# Altium schematic sheet ESP32-SCHEMATIC.SchDoc (part 3 of 3)
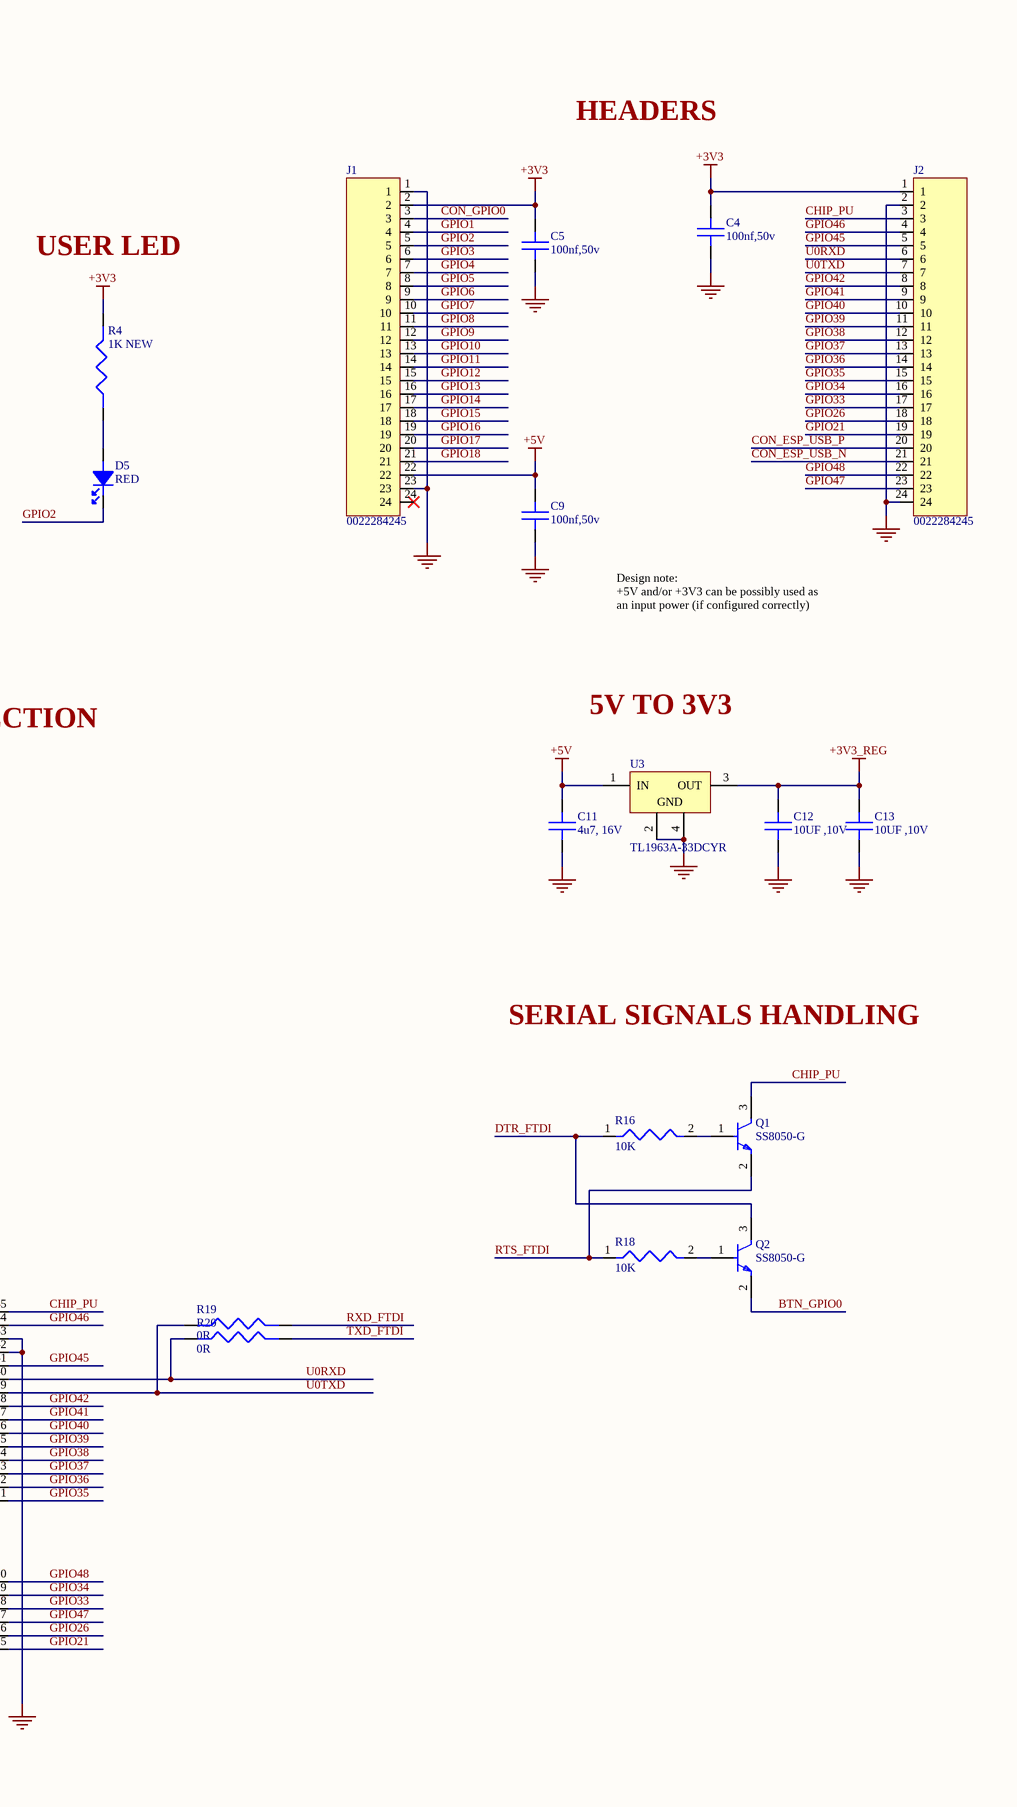
[diagram p3: ESP32-SCHEMATIC.SchDoc, right]

## Library data of the parts (continued)
R9 R13 R16-R18 = SR0402FR-0710KL: 62.5mW Thick Film Resistors 50V ±100ppm/℃ ±1% 10kΩ 0402 Chip Resistor - Surface Mount ROHS; Manufacturer: Yageo Group; Max Power Dissipation: 63mW; Temperature Coefficient: 100ppm/°C; Working Voltage: 75V; Supplier: DigiKey; Supplier Part Number: 13-SR0402FR-0710KLCT-ND; Manufacturer Part Number: SR0402FR-0710KL; RoHS: Compliant; Category: Chip SMD Resistors; Stock: 17860; Pricing: 1=0.24, 10=0.155, 25=0.1444, 50=0.1336, 100=0.101, 250=0.0918, 500=0.08262, 1000=0.07242, 5000=0.0612 (USD); Case/Package: 0402; China RoHS: Non-Compliant; Composition: Thick Film; Features: Automotive AEC-Q200; Height: 350µm; Length: 990.6µm; Lifecycle Status: Production; Max Operating Temperature: 155°C; Min Operating Temperature: -55°C; Mounting Technology: Surface Mount; Number of Terminals: 2; Number of Terminations: 2; Packaging: Tape & Reel; Power Dissipation: 62.5mW; Power Rating: 62.5mW; REACH SVHC: Yes; Value: 10kΩ; Tolerance: 1%; Voltage Rating: 50V; Width: 500µm; ComponentLink1URL: https://datasheet.octopart.com:443/SR0402FR-0710KL-Yageo-datasheet-176402240.pdf?src-supplier=IHS; ComponentLink1Description: https://datasheet.octopart.com:443/SR0402FR-0710KL-Yageo-datasheet-176402240.pdf?src-supplier=IHS; ComponentLink2URL: https://datasheet.octopart.com:443/SR0402FR-0710KL-Yageo-datasheet-119732217.pdf?src-supplier=Upverter; ComponentLink2Description: https://datasheet.octopart.com:443/SR0402FR-0710KL-Yageo-datasheet-119732217.pdf?src-supplier=Upverter; ComponentLink3URL: https://datasheet.octopart.com:443/SR0402FR-0710KL-Yageo-Group-datasheet-155675517.pdf?src-supplier=ODG+(Origin+Data+Global); ComponentLink3Description: https://datasheet.octopart.com:443/SR0402FR-0710KL-Yageo-Group-datasheet-155675517.pdf?src-supplier=ODG+(Origin+Data+Global); ComponentLink4URL: https://datasheet.octopart.com/SR0402FR-0710KL-Yageo-datasheet-11047080.pdf; ComponentLink4Description: https://datasheet.octopart.com/SR0402FR-0710KL-Yageo-datasheet-11047080.pdf; ComponentLink5URL: http://sigma.octopart.com:80/rohs_statement/Yageo-company-2.pdf?src-supplier=Compliance+Statements; ComponentLink5Description: http://sigma.octopart.com:80/rohs_statement/Yageo-company-2.pdf?src-supplier=Compliance+Statements; ComponentLink6URL: http://sigma.octopart.com:80/conflict_mineral_statement/Yageo-company-3.pdf?src-supplier=Compliance+Statements; ComponentLink6Description: http://sigma.octopart.com:80/conflict_mineral_statement/Yageo-company-3.pdf?src-supplier=Compliance+Statements
R10 = RC0402FR-074K7L: Res General Purpose Thick Film 0402 4.7K Ohm 1% 1/16W ±100ppm/°C Molded SMD Paper T/R; Manufacturer: Yageo Group; Power Dissipation: 62.5mW; Power Rating: 63mW; Value: 4.7kΩ; Voltage Rating: 50V; Supplier: DigiKey; Supplier Part Number: 311-4.7KLRDKR-ND; Manufacturer Part Number: RC0402FR-074K7L; RoHS: Compliant; Category: Chip SMD Resistors; Stock: 3604211; Pricing: 1=0.1, 10=0.010, 25=0.008, 50=0.0062, 100=0.0056, 250=0.00508, 500=0.00408 (USD); Case/Package: 0402; Case Code (Imperial): 0402; Case Code (Metric): 1005; China RoHS: Non-Compliant; Composition: Thick Film; Depth: 500µm; Height: 350µm; Lead Free: Lead Free; Length: 1mm; Lifecycle Status: Production; Max Operating Temperature: 155°C; Military Standard: Not; Min Operating Temperature: -55°C; Mounting Technology: Surface Mount; Pins: 2; Number of Terminals: 2; Packaging: Tape & Reel; REACH SVHC: Yes; Schedule B: 8533210045, 8533210045|8533210045, 8533210045|8533210045|8533210045, 8533210045|8533210045|8533210045|8533210045; Temperature Coefficient: 100ppm/°C; Termination: SMD/SMT; Tolerance: 1%; Voltage Rating (AC): 50V; Voltage Rating (DC): 50V; Width: 500µm; Working Voltage: 50V; ComponentLink1URL: https://datasheet.octopart.com:443/RC0402FR-074K7L-Yageo-datasheet-175887523.pdf?src-supplier=IHS; ComponentLink1Description: https://datasheet.octopart.com:443/RC0402FR-074K7L-Yageo-datasheet-175887523.pdf?src-supplier=IHS; ComponentLink2URL: https://datasheet.octopart.com:443/RC0402FR-074K7L-Yageo-datasheet-103092701.pdf?src-supplier=Upverter; ComponentLink2Description: https://datasheet.octopart.com:443/RC0402FR-074K7L-Yageo-datasheet-103092701.pdf?src-supplier=Upverter; ComponentLink3URL: https://datasheet.octopart.com:443/RC0402FR-074K7L-Yageo-datasheet-98239111.pdf?src-supplier=Upverter; ComponentLink3Description: https://datasheet.octopart.com:443/RC0402FR-074K7L-Yageo-datasheet-98239111.pdf?src-supplier=Upverter; ComponentLink4URL: https://datasheet.octopart.com:443/RC0402FR-074K7L-Yageo-datasheet-10408619.pdf?src-supplier=element14+APAC; ComponentLink4Description: https://datasheet.octopart.com:443/RC0402FR-074K7L-Yageo-datasheet-10408619.pdf?src-supplier=element14+APAC; ComponentLink5URL: https://datasheet.octopart.com:443/RC0402FR-074K7L-Yageo-datasheet-13691069.pdf?src-supplier=element14+APAC; ComponentLink5Description: https://datasheet.octopart.com:443/RC0402FR-074K7L-Yageo-datasheet-13691069.pdf?src-supplier=element14+APAC; ComponentLink6URL: https://datasheet.octopart.com:443/RC0402FR-074K7L-Yageo-datasheet-12531192.pdf?src-supplier=Newark; ComponentLink6Description: https://datasheet.octopart.com:443/RC0402FR-074K7L-Yageo-datasheet-12531192.pdf?src-supplier=Newark; ComponentLink7URL: https://datasheet.octopart.com:443/RC0402FR-074K7L-Yageo-datasheet-8324527.pdf?src-supplier=Newark; ComponentLink7Description: https://datasheet.octopart.com:443/RC0402FR-074K7L-Yageo-datasheet-8324527.pdf?src-supplier=Newark; ComponentLink8URL: https://datasheet.octopart.com:443/RC0402FR-074K7L-Yageo-datasheet-62067350.pdf?src-supplier=Farnell; ComponentLink8Description: https://datasheet.octopart.com:443/RC0402FR-074K7L-Yageo-datasheet-62067350.pdf?src-supplier=Farnell; ComponentLink9URL: https://datasheet.octopart.com:443/RC0402FR-074K7L-Yageo-datasheet-8329306.pdf?src-supplier=element14; ComponentLink9Description: https://datasheet.octopart.com:443/RC0402FR-074K7L-Yageo-datasheet-8329306.pdf?src-supplier=element14; ComponentLink10URL: https://datasheet.octopart.com:443/RC0402FR-074K7L-Yageo-datasheet-175423674.pdf?src-supplier=SOS+electronic; ComponentLink10Description: https://datasheet.octopart.com:443/RC0402FR-074K7L-Yageo-datasheet-175423674.pdf?src-supplier=SOS+electronic; ComponentLink11URL: https://datasheet.octopart.com:443/RC0402FR-074K7L-Yageo-datasheet-164759695.pdf?src-supplier=Future+Electronics; ComponentLink11Description: https://datasheet.octopart.com:443/RC0402FR-074K7L-Yageo-datasheet-164759695.pdf?src-supplier=Future+Electronics; ComponentLink12URL: https://datasheet.octopart.com:443/RC0402FR-074K7L-Yageo-datasheet-137700087.pdf?src-supplier=Future+Electronics; ComponentLink12Description: https://datasheet.octopart.com:443/RC0402FR-074K7L-Yageo-datasheet-137700087.pdf?src-supplier=Future+Electronics; ComponentLink13URL: https://datasheet.octopart.com:443/RC0402FR-074K7L-Yageo-datasheet-79472498.pdf?src-supplier=Megastar; ComponentLink13Description: https://datasheet.octopart.com:443/RC0402FR-074K7L-Yageo-datasheet-79472498.pdf?src-supplier=Megastar; ComponentLink14URL: https://datasheet.octopart.com/RC0402FR-074K7L-Yageo-datasheet-73766026.pdf; ComponentLink14Description: https://datasheet.octopart.com/RC0402FR-074K7L-Yageo-datasheet-73766026.pdf; ComponentLink15URL: http://sigma.octopart.com:80/rohs_statement/Yageo-company-2.pdf?src-supplier=Compliance+Statements; ComponentLink15Description: http://sigma.octopart.com:80/rohs_statement/Yageo-company-2.pdf?src-supplier=Compliance+Statements; ComponentLink16URL: http://sigma.octopart.com:80/conflict_mineral_statement/Yageo-company-3.pdf?src-supplier=Compliance+Statements; ComponentLink16Description: http://sigma.octopart.com:80/conflict_mineral_statement/Yageo-company-3.pdf?src-supplier=Compliance+Statements
R11 R12 R14 R15 = AC0402FR-075K1L: 62.5mW Thick Film Resistors 50V ±100ppm/℃ ±1% 5.1kΩ 0402 Chip Resistor - Surface Mount ROHS; Manufacturer: Yageo Group; Max Power Dissipation: 63mW; Temperature Coefficient: 100ppm/°C; Supplier: DigiKey; Supplier Part Number: YAG3503CT-ND; Manufacturer Part Number: AC0402FR-075K1L; RoHS: Compliant; Category: Chip SMD Resistors; Stock: 113557; Pricing: 1=0.1, 10=0.009, 25=0.008, 50=0.0072, 100=0.0066, 250=0.00576, 500=0.00406 (USD); Case/Package: 0402; Case Code (Imperial): 0402; Case Code (Metric): 1005; China RoHS: Non-Compliant; Composition: Thick Film; Depth: 500µm; Features: Automotive AEC-Q200, Moisture Resistant; Height: 320µm; Lead Free: Lead Free; Length: 990.6µm; Lifecycle Status: Production; Max Operating Temperature: 155°C; Military Standard: Not; Min Operating Temperature: -55°C; Mounting Technology: Surface Mount; Number of Terminals: 2; Number of Terminations: 2; Power Dissipation: 62.5mW; Power Rating: 62.5mW; REACH SVHC: Yes; Value: 5.1kΩ; Schedule B: 8533210045, 8533210045|8533210045|8533210045|8533210045|8533210045|8533210045|8533210045|8533210045|8533210045|8533210045|8533210045|8533210045|8533210045|8533210045|8533210045|8533210045|8533210045|8533210045|8533210045|8533210045|8533210045|8533210045|8533210045|85; Tolerance: 1%; Voltage Rating: 50V; Width: 500µm; Working Voltage: 50V; ComponentLink1URL: https://datasheet.octopart.com:443/AC0402FR-075K1L-Yageo-datasheet-182189377.pdf?src-supplier=IHS; ComponentLink1Description: https://datasheet.octopart.com:443/AC0402FR-075K1L-Yageo-datasheet-182189377.pdf?src-supplier=IHS; ComponentLink2URL: https://datasheet.octopart.com:443/AC0402FR-075K1L-Yageo-datasheet-83209224.pdf?src-supplier=Upverter; ComponentLink2Description: https://datasheet.octopart.com:443/AC0402FR-075K1L-Yageo-datasheet-83209224.pdf?src-supplier=Upverter; ComponentLink3URL: https://datasheet.octopart.com:443/AC0402FR-075K1L-Yageo-datasheet-178509465.pdf?src-supplier=Newark; ComponentLink3Description: https://datasheet.octopart.com:443/AC0402FR-075K1L-Yageo-datasheet-178509465.pdf?src-supplier=Newark; ComponentLink4URL: https://datasheet.octopart.com/AC0402FR-075K1L-Yageo-datasheet-12512238.pdf; ComponentLink4Description: https://datasheet.octopart.com/AC0402FR-075K1L-Yageo-datasheet-12512238.pdf; ComponentLink5URL: https://datasheet.octopart.com:443/AC0402FR-075K1L-Yageo-datasheet-166720450.pdf?src-supplier=Future+Electronics; ComponentLink5Description: https://datasheet.octopart.com:443/AC0402FR-075K1L-Yageo-datasheet-166720450.pdf?src-supplier=Future+Electronics; ComponentLink6URL: https://datasheet.octopart.com:443/AC0402FR-075K1L-Yageo-datasheet-151884373.pdf?src-supplier=Future+Electronics; ComponentLink6Description: https://datasheet.octopart.com:443/AC0402FR-075K1L-Yageo-datasheet-151884373.pdf?src-supplier=Future+Electronics; ComponentLink7URL: https://datasheet.octopart.com:443/AC0402FR-075K1L-Yageo-datasheet-137699919.pdf?src-supplier=Future+Electronics; ComponentLink7Description: https://datasheet.octopart.com:443/AC0402FR-075K1L-Yageo-datasheet-137699919.pdf?src-supplier=Future+Electronics; ComponentLink8URL: https://datasheet.octopart.com:443/AC0402FR-075K1L-Yageo-datasheet-24580492.pdf?src-supplier=Future+Electronics; ComponentLink8Description: https://datasheet.octopart.com:443/AC0402FR-075K1L-Yageo-datasheet-24580492.pdf?src-supplier=Future+Electronics; ComponentLink9URL: https://datasheet.octopart.com:443/AC0402FR-075K1L-Yageo-datasheet-13029202.pdf?src-supplier=Future+Electronics; ComponentLink9Description: https://datasheet.octopart.com:443/AC0402FR-075K1L-Yageo-datasheet-13029202.pdf?src-supplier=Future+Electronics; ComponentLink10URL: https://datasheet.octopart.com:443/AC0402FR-075K1L-Yageo-Group-datasheet-164768995.pdf?src-supplier=ODG+(Origin+Data+Global); ComponentLink10Description: https://datasheet.octopart.com:443/AC0402FR-075K1L-Yageo-Group-datasheet-164768995.pdf?src-supplier=ODG+(Origin+Data+Global); ComponentLink11URL: http://sigma.octopart.com:80/rohs_statement/Yageo-company-2.pdf?src-supplier=Compliance+Statements; ComponentLink11Description: http://sigma.octopart.com:80/rohs_statement/Yageo-company-2.pdf?src-supplier=Compliance+Statements; ComponentLink12URL: http://sigma.octopart.com:80/conflict_mineral_statement/Yageo-company-3.pdf?src-supplier=Compliance+Statements; ComponentLink12Description: http://sigma.octopart.com:80/conflict_mineral_statement/Yageo-company-3.pdf?src-supplier=Compliance+Statements
SW1 SW2 = PTS645SH50SMTR92LFS: Switch Tactile N.O. SPST Round Button Gull Wing 0.05A 12VDC 100000Cycles 1.96N SMD T/R; Manufacturer: C&K Components; Actuator Material: Nylon, Polyamide; Contact Current Rating: 50mA; Contact Resistance: 100mΩ; Electrical Life: 100kcycles; Illumination Type: Illuminated, Non-Illuminated; Insulation Resistance: 100GΩ; Max Voltage Rating (DC): 12V; Number of Positions: 1; Switch Function: Off-Mom; Supplier: DigiKey; Supplier Part Number: CKN9085DKR-ND; Manufacturer Part Number: PTS645SH50SMTR92LFS; RoHS: Compliant; Category: Tactile Switches; Stock: 12347; Pricing: 1=0.35, 10=0.3, 25=0.2804, 100=0.251, 250=0.23256, 500=0.21948 (USD); Case/Package: SMD/SMT; Color: Black; Contact Material: Bronze; Contact Plating: Silver; Current Rating: 50mA; Depth: 9mm; Height: 3.4544mm; Lead Free: Lead Free; Length: 6mm; Life (Cycles): 100kcycles; Lifecycle Status: Production; Max Current Rating: 50mA; Max Operating Temperature: 60°C; Mechanical Life: 100kcycles; Min Operating Temperature: -20°C; Mounting Technology: Surface Mount; Operating Force: 1.96N; Orientation: Straight; Packaging: Tape & Reel (TR); REACH SVHC: Yes; Termination: Gull Wing; Throw Configuration: SPST; Voltage Rating (DC): 12V; ComponentLink1URL: https://datasheet.octopart.com:443/PTS645SH50SMTR92LFS-C%26K-Components-datasheet-169841344.pdf?src-supplier=Farnell; ComponentLink1Description: https://datasheet.octopart.com:443/PTS645SH50SMTR92LFS-C%26K-Components-datasheet-169841344.pdf?src-supplier=Farnell; ComponentLink2URL: https://datasheet.octopart.com:443/PTS645SH50SMTR92LFS-C%26K-Components-datasheet-165782998.pdf?src-supplier=Farnell; ComponentLink2Description: https://datasheet.octopart.com:443/PTS645SH50SMTR92LFS-C%26K-Components-datasheet-165782998.pdf?src-supplier=Farnell; ComponentLink3URL: https://datasheet.octopart.com:443/PTS645SH50SMTR92LFS-C%26K-Components-datasheet-67873720.pdf?src-supplier=Upverter; ComponentLink3Description: https://datasheet.octopart.com:443/PTS645SH50SMTR92LFS-C%26K-Components-datasheet-67873720.pdf?src-supplier=Upverter; ComponentLink4URL: https://datasheet.octopart.com:443/PTS645SH50SMTR92-LFS-C%26K-Components-datasheet-141421486.pdf?src-supplier=Upverter; ComponentLink4Description: https://datasheet.octopart.com:443/PTS645SH50SMTR92-LFS-C%26K-Components-datasheet-141421486.pdf?src-supplier=Upverter; ComponentLink5URL: https://datasheet.octopart.com:443/PTS645SH50SMTR92-LFS-C%26K-Components-datasheet-110647872.pdf?src-supplier=TME; ComponentLink5Description: https://datasheet.octopart.com:443/PTS645SH50SMTR92-LFS-C%26K-Components-datasheet-110647872.pdf?src-supplier=TME; ComponentLink6URL: https://datasheet.octopart.com:443/PTS645SH50SMTR-92-LFS-C%26K-Components-datasheet-150821959.pdf?src-supplier=TME; ComponentLink6Description: https://datasheet.octopart.com:443/PTS645SH50SMTR-92-LFS-C%26K-Components-datasheet-150821959.pdf?src-supplier=TME; ComponentLink7URL: https://datasheet.octopart.com:443/PTS645SH50SMTR92LFS-C%26K-Components-datasheet-138128951.pdf?src-supplier=Future+Electronics; ComponentLink7Description: https://datasheet.octopart.com:443/PTS645SH50SMTR92LFS-C%26K-Components-datasheet-138128951.pdf?src-supplier=Future+Electronics; ComponentLink8URL: https://datasheet.octopart.com:443/PTS645SH50SMTR92LFS-C%26K-Components-datasheet-62111174.pdf?src-supplier=Future+Electronics; ComponentLink8Description: https://datasheet.octopart.com:443/PTS645SH50SMTR92LFS-C%26K-Components-datasheet-62111174.pdf?src-supplier=Future+Electronics; ComponentLink9URL: https://datasheet.octopart.com:443/PTS645SH50SMTR92LFS-C%26K-Components-datasheet-24578962.pdf?src-supplier=Future+Electronics; ComponentLink9Description: https://datasheet.octopart.com:443/PTS645SH50SMTR92LFS-C%26K-Components-datasheet-24578962.pdf?src-supplier=Future+Electronics; ComponentLink10URL: https://datasheet.octopart.com:443/PTS645SH50SMTR92-LFS-C%26K-Components-datasheet-12590747.pdf?src-supplier=Future+Electronics; ComponentLink10Description: https://datasheet.octopart.com:443/PTS645SH50SMTR92-LFS-C%26K-Components-datasheet-12590747.pdf?src-supplier=Future+Electronics
U1 = ESP32-S3-MINI-1-N8: SMD module, ESP32-S3FN8, 8 MB SPI flash, PCB antenna; Manufacturer: Espressif Systems; Supplier: DigiKey; Supplier Part Number: 5407-ESP32-S3-MINI-1-N8DKR-ND; Manufacturer Part Number: ESP32-S3-MINI-1-N8; RoHS: Compliant; Category: RF Transceiver Modules and Modems; Stock: 4605; Pricing: 1=5.28, 10=4.566, 25=4.3196, 100=3.9802, 250=3.7768 (USD); ComponentLink1URL: https://datasheet.octopart.com:443/ESP32-S3-MINI-1-N8-Espressif-Systems-datasheet-188867343.pdf?src-supplier=TME; ComponentLink1Description: https://datasheet.octopart.com:443/ESP32-S3-MINI-1-N8-Espressif-Systems-datasheet-188867343.pdf?src-supplier=TME; ComponentLink2URL: https://datasheet.octopart.com:443/ESP32-S3-MINI-1-N8-Espressif-Systems-datasheet-165560562.pdf?src-supplier=TME; ComponentLink2Description: https://datasheet.octopart.com:443/ESP32-S3-MINI-1-N8-Espressif-Systems-datasheet-165560562.pdf?src-supplier=TME; ComponentLink3URL: https://datasheet.octopart.com:443/ESP32-S3-MINI-1-N8-Espressif-Systems-datasheet-165560559.pdf?src-supplier=TME; ComponentLink3Description: https://datasheet.octopart.com:443/ESP32-S3-MINI-1-N8-Espressif-Systems-datasheet-165560559.pdf?src-supplier=TME
U2 = FT231XQ-R: Tape & Reel (TR) 2006 UART USB 2.0 interface controller 3.3V~5V 4mm 8mA 12Mbps; Manufacturer: FTDI; Interface: UART, USB; Clock Frequency: 12.02MHz; Max Supply Current: 8.4mA; Max Supply Voltage: 5.5V; Min Supply Voltage: 2.97V; Number of Channels: 1; Operating Supply Voltage: 5V; Supplier: DigiKey; Supplier Part Number: 768-1128-6-ND; Manufacturer Part Number: FT231XQ-R; RoHS: Compliant; Category: Interface ICs; Pricing: 1=2.34, 25=2.27, 100=2.2, 250=2, 500=1.82002, 1000=1.7625 (USD); Ambient Temperature Range High: 85°C; Case/Package: QFN; Data Rate: 12Mbps; Height: 800µm; Height - Seated (Max): 800µm; Lead Free: Lead Free; Length: 4mm; Lifecycle Status: Production; Max Operating Temperature: 85°C; Min Operating Temperature: -40°C; Mounting Technology: Surface Mount; Pins: 20; Number of Terminals: 20; Operating Supply Current: 8mA; REACH SVHC: Yes; Terminal Pitch: 500µm; Weight: 123.008581mg; Width: 4mm; ComponentLink1URL: https://datasheet.octopart.com:443/FT231XQ-R-FTDI-datasheet-182343132.pdf?src-supplier=IHS; ComponentLink1Description: https://datasheet.octopart.com:443/FT231XQ-R-FTDI-datasheet-182343132.pdf?src-supplier=IHS; ComponentLink2URL: https://datasheet.octopart.com:443/FT231XQ-R-FTDI-datasheet-11021087.pdf?src-supplier=ODG+(Origin+Data+Global); ComponentLink2Description: https://datasheet.octopart.com:443/FT231XQ-R-FTDI-datasheet-11021087.pdf?src-supplier=ODG+(Origin+Data+Global); ComponentLink3URL: https://datasheet.octopart.com:443/FT231XQ-R-FTDI-datasheet-28834672.pdf?src-supplier=SOS+electronic; ComponentLink3Description: https://datasheet.octopart.com:443/FT231XQ-R-FTDI-datasheet-28834672.pdf?src-supplier=SOS+electronic; ComponentLink4URL: https://datasheet.octopart.com:443/FT231XQ-R-FTDI-datasheet-68321328.pdf?src-supplier=TME; ComponentLink4Description: https://datasheet.octopart.com:443/FT231XQ-R-FTDI-datasheet-68321328.pdf?src-supplier=TME; ComponentLink5URL: https://datasheet.octopart.com:443/FT231XQ-R-FTDI-datasheet-134530624.pdf?src-supplier=SHENGYU+ELECTRONICS; ComponentLink5Description: https://datasheet.octopart.com:443/FT231XQ-R-FTDI-datasheet-134530624.pdf?src-supplier=SHENGYU+ELECTRONICS
U3 = TL1963A-33DCYR: 1.5-A, 20-V, low-dropout voltage regulator with reverse current & reverse voltage protection; Manufacturer: Texas Instruments; Manufacturer Lifecycle Status: ACTIVE; Accuracy: 3%; Dropout Voltage: 340mV; Input Bias Current: 1mA; Max Supply Voltage: 20V; Max Output current: 1.5A; Max Output Voltage: 3.3V; Min Current Limit: 1.6A; Min Input Voltage: 2.1V; Number of Outputs: 1; Output Type: Fixed; Polarity: Positive; Supplier: DigiKey; Supplier Part Number: 296-24897-1-ND; Manufacturer Part Number: TL1963A-33DCYR; RoHS: Compliant; Category: LDO Voltage Regulators; Stock: 5365; Pricing: 1=3.13, 10=2.344, 25=2.1476, 100=1.9323, 250=1.82956, 500=1.76766, 1000=1.71669 (USD); Case/Package: SOT-223; Contact Plating: Tin; Height: 1.8mm; Lead Free: Lead Free; Length: 6.5mm; Lifecycle Status: Production; Max Operating Temperature: 125°C; Min Operating Temperature: -40°C; Min Output Voltage: 3.3V; Nominal Output Voltage: 3.3V; Pins: 4; Number of Regulators: 1; Output Current: 1.5A; Output Voltage: 3.3V; Quiescent Current: 1mA; Radiation Hardening: No; REACH SVHC: No; Schedule B: 8542390000, 8542390000|8542390000|8542390000|8542390000|8542390000; Thickness: 1.6mm; Width: 3.5mm; ComponentLink1URL: https://datasheet.octopart.com:443/TL1963A-33DCYR-Texas-Instruments-datasheet-36835243.pdf?src-supplier=Texas+Instruments; ComponentLink1Description: https://datasheet.octopart.com:443/TL1963A-33DCYR-Texas-Instruments-datasheet-36835243.pdf?src-supplier=Texas+Instruments; ComponentLink2URL: https://octopart.com:443/opatz8j6/c1?t=v9vUVhB4ABoBYeCiISoSNO6AIVqqmIyH8CPMGwjj7iOtSNPIzp0BOMeG-tPqEeUdBX9Ciwl-ccANqFrTAykJ7in4rXCTA07UpycRVB-IRZIbqZzlxAqzmMhvy3gbsep2Wo1FdIj5iBSHxl6p2tHymmAD_SU8eh9naSztiHzvtjf2dRebykuo_BX05xjFA_6tPl0oJjVDQhta1E_HRAm429JM1yHc44YqXXGkn1b5msczBKzJndVGz3VUU7Tkb0xTuWElBqD5Nz2h0-noq8GTU6oiamWiU8oWCCscjWlrm4bOQ8A0jHPgU2T2JEPyth8zcqR_xvx3eTGjqcQuEUVR1jmAzwLaWP0ClKtJXensFikUnu2Qq9jfoGWvqvrzZw6fejHZuPU&src-supplier=Texas+Instruments; ComponentLink2Description: https://octopart.com:443/opatz8j6/c1?t=v9vUVhB4ABoBYeCiISoSNO6AIVqqmIyH8CPMGwjj7iOtSNPIzp0BOMeG-tPqEeUdBX9Ciwl-ccANqFrTAykJ7in4rXCTA07UpycRVB-IRZIbqZzlxAqzmMhvy3gbsep2Wo1FdIj5iBSHxl6p2tHymmAD_SU8eh9naSztiHzvtjf2dRebykuo_BX05xjFA_6tPl0oJjVDQhta1E_HRAm429JM1yHc44YqXXGkn1b5msczBKzJndVGz3VUU7Tkb0xTuWElBqD5Nz2h0-noq8GTU6oiamWiU8oWCCscjWlrm4bOQ8A0jHPgU2T2JEPyth8zcqR_xvx3eTGjqcQuEUVR1jmAzwLaWP0ClKtJXensFikUnu2Qq9jfoGWvqvrzZw6fejHZuPU&src-supplier=Texas+Instruments; ComponentLink3URL: https://datasheet.octopart.com:443/TL1963A-33DCYR-Texas-Instruments-datasheet-10255270.pdf?src-supplier=Texas+Instruments; ComponentLink3Description: https://datasheet.octopart.com:443/TL1963A-33DCYR-Texas-Instruments-datasheet-10255270.pdf?src-supplier=Texas+Instruments; ComponentLink4URL: https://sigma.octopart.com:443/49253063/technical_drawing/Texas-Instruments-TL1963A-33DCYR.pdf?src-supplier=Texas+Instruments; ComponentLink4Description: https://sigma.octopart.com:443/49253063/technical_drawing/Texas-Instruments-TL1963A-33DCYR.pdf?src-supplier=Texas+Instruments; ComponentLink5URL: https://datasheet.octopart.com:443/TL1963A-33DCYR-Texas-Instruments-datasheet-159117591.pdf?src-supplier=Augswan; ComponentLink5Description: https://datasheet.octopart.com:443/TL1963A-33DCYR-Texas-Instruments-datasheet-159117591.pdf?src-supplier=Augswan; ComponentLink6URL: https://datasheet.octopart.com:443/TL1963A-33DCYR-Texas-Instruments-datasheet-21820479.pdf?src-supplier=Newark; ComponentLink6Description: https://datasheet.octopart.com:443/TL1963A-33DCYR-Texas-Instruments-datasheet-21820479.pdf?src-supplier=Newark; ComponentLink7URL: https://datasheet.octopart.com:443/TL1963A-33DCYR-Texas-Instruments-datasheet-16079880.pdf?src-supplier=Farnell; ComponentLink7Description: https://datasheet.octopart.com:443/TL1963A-33DCYR-Texas-Instruments-datasheet-16079880.pdf?src-supplier=Farnell; ComponentLink8URL: https://datasheet.octopart.com:443/TL1963A-33DCYR-Texas-Instruments-datasheet-14171511.pdf?src-supplier=iiiC; ComponentLink8Description: https://datasheet.octopart.com:443/TL1963A-33DCYR-Texas-Instruments-datasheet-14171511.pdf?src-supplier=iiiC; ComponentLink9URL: http://sigma.octopart.com:80/conflict_mineral_statement/Texas-Instruments-company-63.pdf?src-supplier=Compliance+Statements; ComponentLink9Description: http://sigma.octopart.com:80/conflict_mineral_statement/Texas-Instruments-company-63.pdf?src-supplier=Compliance+Statements; ComponentLink10URL: http://sigma.octopart.com:80/reach_statement/Texas-Instruments-company-64.pdf?src-supplier=Compliance+Statements; ComponentLink10Description: http://sigma.octopart.com:80/reach_statement/Texas-Instruments-company-64.pdf?src-supplier=Compliance+Statements